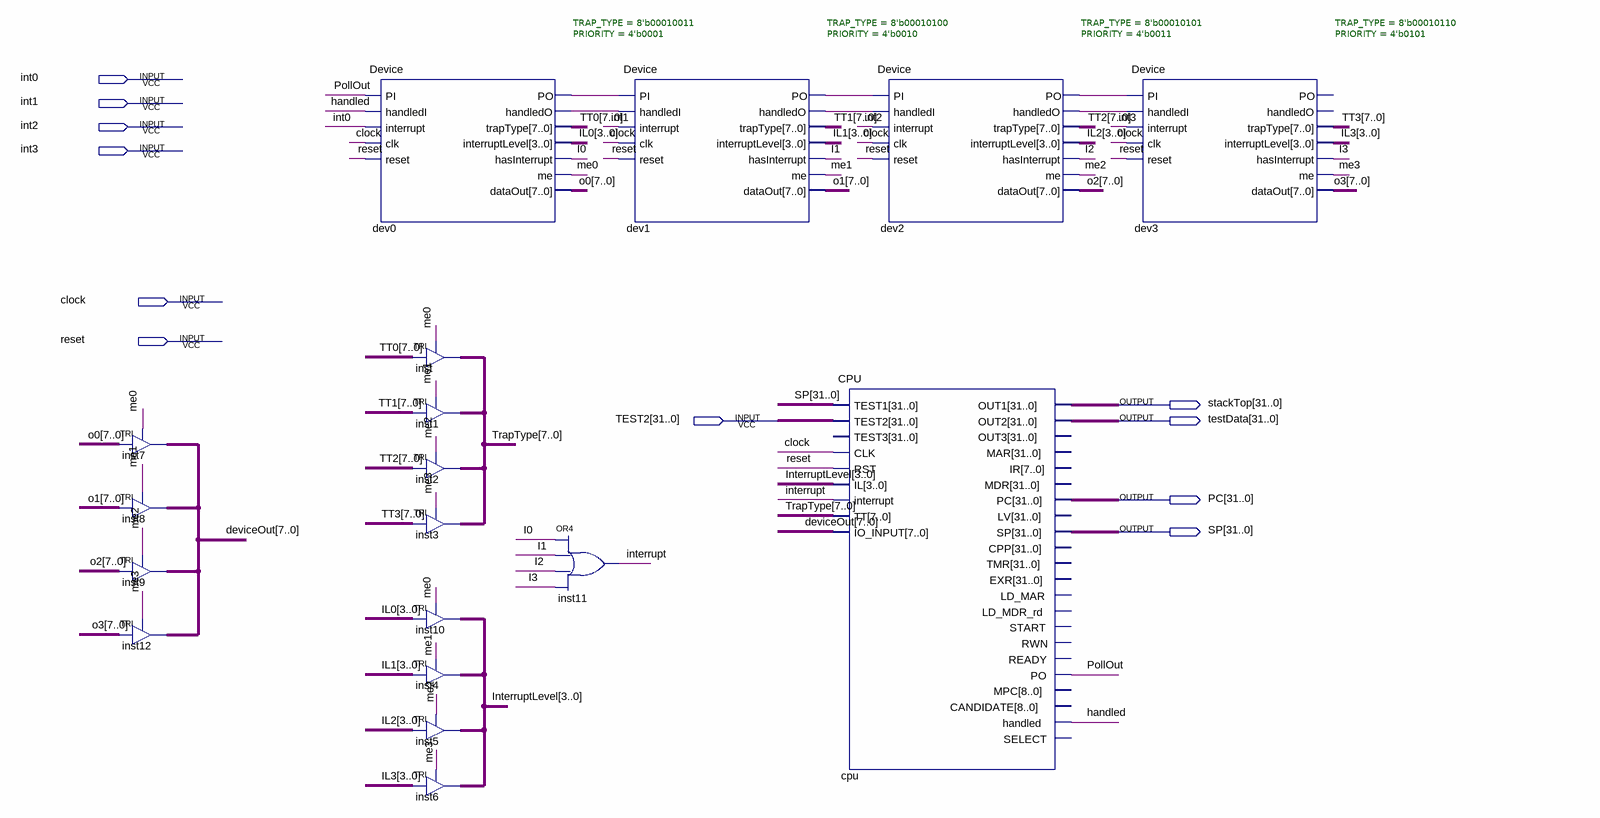
[diagram p0: schematic sheet]
// Quartus schematic wholeComputer.bdf as structural Verilog: 18 symbols, 11 pins
module wholeComputer (
  input  int0,
  input  int1,
  input  int2,
  input  int3,
  input  clock,
  input  reset,
  input  [31:0] TEST2,
  output [31:0] stackTop,
  output [31:0] testData,
  output [31:0] PC,
  output [31:0] SP
);

  wire dev0_handledo, dev0_po, dev1_handledo, dev1_po, dev2_handledo, dev2_po, handled, I0, I1, I2, I3,
       interrupt, me0, me1, me2, me3, PollOut;
  wire [3:0] IL0, IL1, IL2, IL3, InterruptLevel;
  wire [7:0] deviceOut, o0, o1, o2, o3, TrapType, TT0, TT1, TT2, TT3;

  TRI inst7[7:0] (.IN(o0), .OE(me0), .OUT(deviceOut));
  TRI inst8[7:0] (.IN(o1), .OE(me1), .OUT(deviceOut));
  TRI inst9[7:0] (.IN(o2), .OE(me2), .OUT(deviceOut));
  TRI inst12[7:0] (.IN(o3), .OE(me3), .OUT(deviceOut));
  Device #(.TRAP_TYPE(8'b00010011), .PRIORITY(4'b0001)) dev0 (
    .PI(PollOut), .handledI(handled), .interrupt(int0), .clk(clock), .reset(reset), .PO(dev0_po),
    .handledO(dev0_handledo), .trapType(TT0), .interruptLevel(IL0), .hasInterrupt(I0), .me(me0), .dataOut(o0));
  TRI inst[7:0] (.IN(TT0), .OE(me0), .OUT(TrapType));
  TRI inst1[7:0] (.IN(TT1), .OE(me1), .OUT(TrapType));
  TRI inst2[7:0] (.IN(TT2), .OE(me2), .OUT(TrapType));
  TRI inst3[7:0] (.IN(TT3), .OE(me3), .OUT(TrapType));
  TRI inst10[3:0] (.IN(IL0), .OE(me0), .OUT(InterruptLevel));
  TRI inst4[3:0] (.IN(IL1), .OE(me1), .OUT(InterruptLevel));
  TRI inst5[3:0] (.IN(IL2), .OE(me2), .OUT(InterruptLevel));
  TRI inst6[3:0] (.IN(IL3), .OE(me3), .OUT(InterruptLevel));
  or inst11 (interrupt, I0, I1, I2, I3);
  Device #(.TRAP_TYPE(8'b00010100), .PRIORITY(4'b0010)) dev1 (
    .PI(dev0_po), .handledI(dev0_handledo), .interrupt(int1), .clk(clock), .reset(reset), .PO(dev1_po),
    .handledO(dev1_handledo), .trapType(TT1), .interruptLevel(IL1), .hasInterrupt(I1), .me(me1), .dataOut(o1));
  Device #(.TRAP_TYPE(8'b00010101), .PRIORITY(4'b0011)) dev2 (
    .PI(dev1_po), .handledI(dev1_handledo), .interrupt(int2), .clk(clock), .reset(reset), .PO(dev2_po),
    .handledO(dev2_handledo), .trapType(TT2), .interruptLevel(IL2), .hasInterrupt(I2), .me(me2), .dataOut(o2));
  CPU cpu (
    .TEST1(SP), .TEST2(TEST2), .CLK(clock), .RST(reset), .IL(InterruptLevel), .interrupt(interrupt),
    .TT(TrapType), .IO_INPUT(deviceOut), .OUT1(stackTop), .OUT2(testData), .PC(PC), .SP(SP), .PO(PollOut),
    .handled(handled));  // open: TEST3, OUT3, MAR, IR, MDR, LV, CPP, TMR, EXR, LD_MAR, LD_MDR_rd, START, RWN, READY, MPC, CANDIDATE, SELECT
  Device #(.TRAP_TYPE(8'b00010110), .PRIORITY(4'b0101)) dev3 (
    .PI(dev2_po), .handledI(dev2_handledo), .interrupt(int3), .clk(clock), .reset(reset), .trapType(TT3),
    .interruptLevel(IL3), .hasInterrupt(I3), .me(me3), .dataOut(o3));  // open: PO, handledO
endmodule
